# EasyEDA Pro project UHUB.eprj, board UHUB
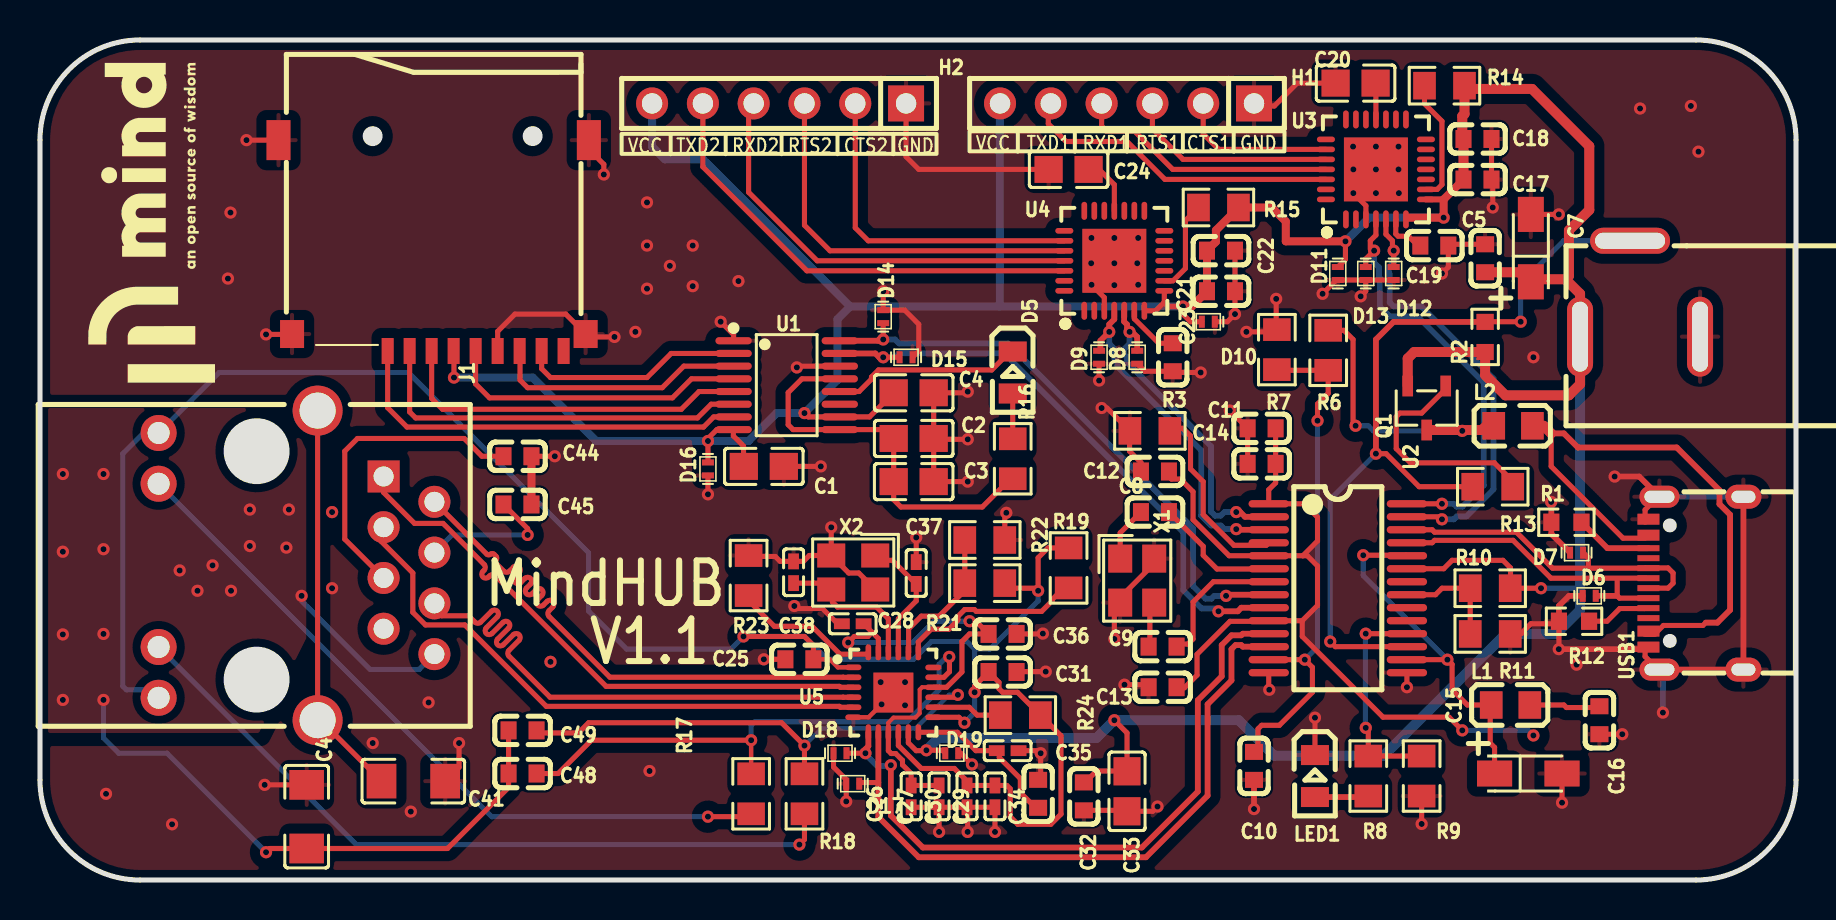
[diagram p4: board, top side]
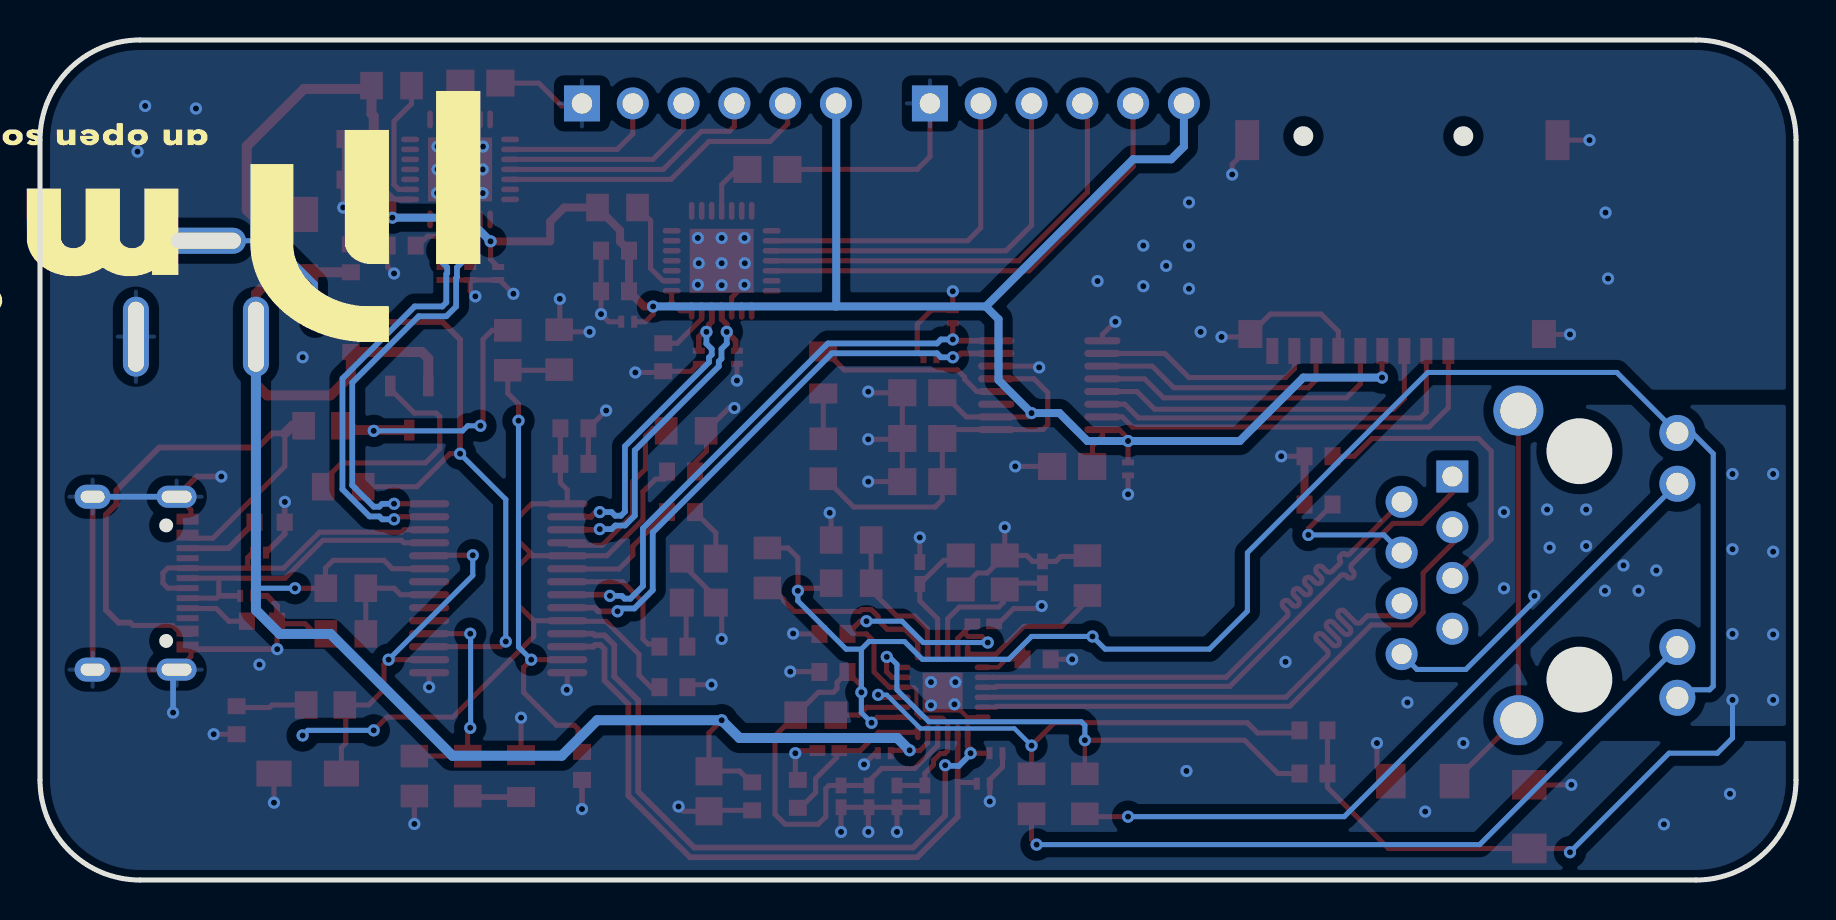
[diagram p5: board, bottom side, seen from below]

Outline 87.81 x 42.03 mm; copper layers: Top Layer, GND1, GND2, Bottom Layer. Coordinates in mm from the lower left corner of the outline.
Outline path: 0,37.03 0,5 arc(1.46,1.46) 5,0 82.81,0 arc(86.34,1.46) 87.81,5 87.81,37.03 arc(86.34,40.57) 82.81,42.03 5,42.03 arc(1.46,40.57) 0,37.03
Stack: Top Layer 0.035mm Outer layer thickness 1oz / Dielectric1 0.2104mm 7628 RC49% 8.6mil / GND1 0.0152mm Inner layer thickness / Dielectric2 1.065mm 1.1mm H/HOZ Copper / GND2 0.0152mm Inner layer thickness / Dielectric3 0.2104mm 7628 RC49% 8.6mil / Bottom Layer 0.035mm Outer layer thickness 1oz

## Design rules (mm)
net DM1: DP2
net DP1: DP2
net DM2: DP3
net DP2: DP3
net MDI0-: DP6
net MDI0+: DP6
net MDI1-: DP7
net MDI1+: DP7
net DP3: DP4
net DM3: DP4
net DM4: DP5
net DP4: DP5
net DP0+: DP1
net DM0-: DP1
template: Custom Config
spacing copperThickness1oz (default): track to track 0.102, other pairs 0.152 to 0.3
spacing copperThickness2oz: track to track 0.203, other pairs 0.152 to 0.3
spacing copperThicknessInner0.5oz: track to track 0.089, other pairs 0.152 to 0.3
track width copperThickness1oz (default): min 0.102, default 0.254, max 2.54
track width copperThickness2oz: min 0.203, default 0.254, max 2.54
track width copperThickness0.5oz: min 0.089, default 0.254, max 2.54
differential pair 100ohm (default): width min 0.127, default 0.22, max 2.54; gap min 0.203, default 0.152
differential pair 90ohm: width min 0.127, default 0.286, max 2.54; gap min 0.203, default 0.203
via viaSize (default): diameter min 0.3, default 0.61, max 10; hole min 0.2, default 0.305, max 6.3

## Placement (name value [footprint] x y rotation side)
C1  100nF  [C0805]  36.19 20.7 180 top
C2  10uF  [C0805]  43.69 22.09 180 top
C3  100nF  [C0805]  43.69 19.93 180 top
C4  10uF  [C0805]  43.69 24.38 180 top
C5  100nF  [C0603]  72.26 31.11 270 top
C7  10uF  [CAP-SMD_L3.2-W1.6-RD-C7171]  74.55 31.62 90 top
C8  20pF  [C0603]  55.75 18.41 180 top
C9  20pF  [C0603]  56.13 11.68 0 top
C10  100nF  [C0603]  60.71 5.71 90 top
C11  100nF  [C0603]  61.09 20.82 0 top
C12  100nF  [C0603]  55.75 20.44 0 top
C13  100nF  [C0603]  56.13 9.65 0 top
C14  100nF  [C0603]  61.09 22.6 0 top
C15  10uF  [CAP-SMD_L3.2-W1.6-RD-C7171]  74.42 5.33 0 top
C16  100nF  [C0603]  77.98 8 90 top
C17  100nF  [C0603]  71.88 35.05 180 top
C18  100nF  [C0603]  71.88 37.08 180 top
C19  100nF  [C0603]  69.72 31.74 0 top
C20  4.7uF  [C0805]  65.79 39.87 0 top
C21  100nF  [C0603]  59.06 29.46 180 top
C22  100nF  [C0603]  59.06 31.49 180 top
C23  100nF  [C0603]  56.64 26.16 270 top
C24  4.7uF  [C0805]  51.44 35.55 0 top
C25  100nF  [C0603]  37.97 11.04 180 top
C26  100nF  [C0402]  43.56 4.19 90 top
C27  100nF  [C0402]  44.96 4.19 90 top
C28  100nF  [C0402]  40.64 12.82 180 top
C29  100nF  [C0402]  47.75 4.19 90 top
C30  4.7nF  [C0402]  46.35 4.19 90 top
C31  100nF  [C0603]  48.13 10.41 0 top
C32  100nF  [C0603]  52.2 4.19 270 top
C33  4.7uF  [C0805]  54.36 4.44 90 top
C34  100nF  [C0603]  49.91 4.31 90 top
C35  4.7nF  [C0402]  48.39 6.47 180 top
C36  100nF  [C0603]  48.13 12.31 0 top
C37  27pF  [C0402]  43.81 15.36 270 top
C38  27pF  [C0402]  37.68 15.4 90 top
C40  1nF  [C1206]  13.33 3.17 270 top
C41  1nF  [C1206]  18.67 4.95 180 top
C44  100nF  [C0603]  23.88 21.2 0 top
C45  100nF  [C0603]  23.88 18.79 0 top
C48  100nF  [C0603]  24.13 5.33 180 top
C49  100nF  [C0603]  24.13 7.49 180 top
CARD1  TF-01A  [TF-SMD_TF-01A]  19.68 31.74 180 top
D5  KT-0805翠绿  [LED0805-R-RD]  48.64 25.39 270 top
D6  H5VL10B  [SOD-882_L1.0-W0.6-BI]  77.47 14.22 0 top
D7  H5VL10B  [SOD-882_L1.0-W0.6-BI]  76.84 16.38 0 top
D8  H5VL10B  [SOD-882_L1.0-W0.6-BI]  54.86 26.16 90 top
D9  H5VL10B  [SOD-882_L1.0-W0.6-BI]  52.96 26.16 90 top
D10  H5VL10B  [SOD-882_L1.0-W0.6-BI]  58.42 27.94 180 top
D11  H5VL10B  [SOD-882_L1.0-W0.6-BI]  64.9 30.35 90 top
D12  H5VL10B  [SOD-882_L1.0-W0.6-BI]  67.69 30.35 90 top
D13  H5VL10B  [SOD-882_L1.0-W0.6-BI]  66.29 30.35 90 top
D14  H5VL10B  [SOD-882_L1.0-W0.6-BI]  42.16 28.19 270 top
D15  H5VL10B  [SOD-882_L1.0-W0.6-BI]  43.31 26.16 180 top
D16  H5VL10B  [SOD-882_L1.0-W0.6-BI]  33.4 20.57 90 top
D17  H5VL10B  [SOD-882_L1.0-W0.6-BI]  40.64 4.82 0 top
D18  H5VL10B  [SOD-882_L1.0-W0.6-BI]  40 6.34 0 top
D19  H5VL10B  [SOD-882_L1.0-W0.6-BI]  45.59 6.34 180 top
DC1  -  [DC-IN-TH_DC-5520-1]  80.01 29.59 180 top
H1  -  [HDR-TH_6P-P2.54-V-F]  54.36 38.86 180 top
H2  -  [HDR-TH_6P-P2.54-V-F]  36.96 38.86 180 top
J1  HR911105A  [RJ45-TH_HR911105A]  12.83 15.74 270 top
L1  GZ2012D101TF  [L0805]  73.53 8.76 0 top
L2  GZ2012D101TF  [L0805]  73.66 22.73 0 top
LED1  KT-0805Y  [LED0805-R-RD]  63.75 5.2 270 top
Q1  SI2301CDS-T1-GE3  [SOT-23-3_L3.0-W1.7-P0.95-LS2.9-BR]  69.34 23.62 90 top
R1  4.7kΩ  [R0805]  72.64 19.68 180 top
R2  510kΩ  [R0603]  72.26 27.17 90 top
R3  680Ω  [R0805]  55.5 22.47 0 top
R6  10kΩ  [R0805]  64.42 26.5 90 top
R7  47kΩ  [R0805]  61.85 26.54 270 top
R8  470Ω  [R0805]  66.42 5.2 90 top
R9  150kΩ  [R0805]  69.09 5.2 90 top
R10  10kΩ  [R0805]  72.52 14.6 0 top
R11  20kΩ  [R0805]  72.52 12.31 180 top
R12  5.1kΩ  [R0603]  76.71 12.95 0 top
R13  5.1kΩ  [R0603]  76.33 17.9 0 top
R14  4.7kΩ  [R0805]  70.23 39.75 180 top
R15  4.7kΩ  [R0805]  58.93 33.65 180 top
R16  1kΩ  [R0805]  48.64 21.08 270 top
R17  680Ω  [R0805]  35.56 4.31 270 top
R18  680Ω  [R0805]  38.23 4.31 270 top
R19  10kΩ  [R0805]  51.44 15.62 90 top
R21  10kΩ  [R0805]  47.24 14.85 0 top
R22  10kΩ  [R0805]  47.24 17.01 0 top
R23  2.4kΩ  [R0805]  35.43 15.23 270 top
R24  10kΩ  [R0805]  49.02 8.25 180 top
U1  GL823K-HCY04  [SSOP-16_L4.9-W3.9-P0.64-LS6.0-BL]  37.34 24.76 270 top
U2  GL850G-HHY60  [SSOP-28_L10.2-W5.3-P0.65-LS7.8-BL]  64.9 14.6 270 top
U3  CP2102-GMR  [WQFN-28_L5.0-W5.0-P0.50-BL-EP3.2]  66.8 35.55 0 top
U4  CP2102-GMR  [WQFN-28_L5.0-W5.0-P0.50-BL-EP3.2]  53.72 30.98 0 top
U5  RTL8152B-VB-CG  [QFN-24_L4.0-W4.0-P0.50-BL-EP2.0]  42.67 9.39 270 top
USB1  TYPE-C 16PIN 2MD(073)  [USB-C-SMD_TYPE-C-6PIN-2MD-073]  82.8 14.85 90 top
X1  12MHz  [CRYSTAL-SMD_4P-L3.2-W2.5-BL]  54.86 14.98 270 top
X2  25MHz  [CRYSTAL-SMD_4P-L3.2-W2.5-BL]  40.67 15.39 180 top

## Footprints (pads in the part's own frame, mm; a bottom-side part is the same pattern mirrored in y, then rotated)
C0402
  rect 0.79x0.54 smd: 1(-0.545,0) 2(0.545,0)
C0603
  rect 0.8x0.9 smd: 1(-0.7,0) 2(0.7,0)
C0805
  rect 1.41x1.35 smd: 1(-1,0) 2(1,0)
C1206
  rect 1.485x1.728 smd: 1(-1.593,0) 2(1.593,0)
CAP-SMD_L3.2-W1.6-RD-C7171
  rect 1.758x1.296 smd: 1(-1.687,0) 2(1.687,0)
CRYSTAL-SMD_4P-L3.2-W2.5-BL
  rect 1.4x1.2 smd: 1(-1.1,-0.85) 2(1.1,-0.85) 3(1.1,0.85) 4(-1.1,0.85)
DC-IN-TH_DC-5520-1
  oval 4x1.3 hole 3.5x0.8: 2(0.5,-2.4)
  oval 1.3x4 hole 0.8x3.5: 3(-3,2.4) 4(3,2.4)
HDR-TH_6P-P2.54-V-F
  rect 1.8x1.8 hole 1.02: 1(-6.35,0)
  round 1.6 hole 1.02: 2(-3.81,0) 3(-1.27,0) 4(1.27,0) 5(3.81,0) 6(6.35,0)
L0805
  rect 1.133x1.377 smd: 1(-0.966,0) 2(0.966,0)
LED0805-R-RD
  rect 1x1.399 smd: 1(1.05,0) 2(-1.05,0)
QFN-24_L4.0-W4.0-P0.50-BL-EP2.0
  oval 0.28x0.8 smd: 1(-1.25,-2) 2(-0.75,-2) 3(-0.25,-2) 4(0.25,-2) 5(0.75,-2) 6(1.25,-2) 13(1.25,2) 14(0.75,2) 15(0.25,2) 16(-0.25,2) 17(-0.75,2) 18(-1.242,2)
  oval 0.8x0.28 smd: 7(2,-1.25) 8(2,-0.75) 9(2,-0.25) 10(2,0.25) 11(2,0.75) 12(2,1.25) 19(-2,1.25) 20(-2,0.75) 21(-2,0.25) 22(-2,-0.25) 23(-2,-0.75) 24(-2,-1.25)
  rect 2x2 smd: 25(0.013,0)
R0603
  rect 0.806x0.864 smd: 1(-0.753,0) 2(0.753,0)
R0805
  rect 1.133x1.377 smd: 1(-1,0) 2(1,0)
RJ45-TH_HR911105A
  rect 1.6x1.6 hole 1: 1(-4.45,4.355)
  round 1.6 hole 1: 2(-3.18,6.895) 3(-1.91,4.355) 4(-0.64,6.895) 5(0.63,4.355) 6(1.9,6.895) 7(3.17,4.355) 8(4.44,6.895)
  round 1.8 hole 1.1: 9(-6.625,-6.895) 10(-4.085,-6.895) 11(4.085,-6.895) 12(6.625,-6.895)
  round 2.5 hole 1.8: SH1(-7.745,1.055) SH2(7.745,1.055)
SOD-882_L1.0-W0.6-BI
  rect 0.3x0.6 smd: 1(-0.325,0) 2(0.325,0)
SOT-23-3_L3.0-W1.7-P0.95-LS2.9-BR
  rect 1.038x0.532 smd: 1(1.101,-0.95) 2(1.101,0.95) 3(-1.101,0)
SSOP-16_L4.9-W3.9-P0.64-LS6.0-BL
  oval 0.355x1.815 smd: 1(-2.223,-2.655) 2(-1.587,-2.655) 3(-0.953,-2.655) 4(-0.318,-2.655) 5(0.318,-2.655) 6(0.953,-2.655) 7(1.587,-2.655) 8(2.223,-2.655) 9(2.223,2.655) 10(1.587,2.655) 11(0.953,2.655) 12(0.318,2.655) 13(-0.318,2.655) 14(-0.953,2.655) 15(-1.587,2.655) 16(-2.223,2.655)
SSOP-28_L10.2-W5.3-P0.65-LS7.8-BL
  oval 0.364x2.015 smd: 1(-4.225,-3.455) 2(-3.575,-3.455) 3(-2.925,-3.455) 4(-2.275,-3.455) 5(-1.625,-3.455) 6(-0.975,-3.455) 7(-0.325,-3.455) 8(0.325,-3.455) 9(0.975,-3.455) 10(1.625,-3.455) 11(2.275,-3.455) 12(2.925,-3.455) 13(3.575,-3.455) 14(4.225,-3.455) 15(4.225,3.455) 16(3.575,3.455) 17(2.925,3.455) 18(2.275,3.455) 19(1.625,3.455) 20(0.975,3.455) 21(0.325,3.455) 22(-0.325,3.455) 23(-0.975,3.455) 24(-1.625,3.455) 25(-2.275,3.455) 26(-2.925,3.455) 27(-3.575,3.455) 28(-4.225,3.455)
TF-SMD_TF-01A
  rect 0.6x1.3 smd: 1(2.3,5.276) 2(1.2,5.276) 3(0.101,5.276) 4(-1,5.276) 5(-2.099,5.276) 6(-3.2,5.276) 7(-4.3,5.276) 8(-5.399,5.276) 9(-6.5,5.276)
  rect 1.2x1.4 smd: 10(-7.599,4.426) 13(7.08,4.426)
  rect 1.2x2 smd: 11(-7.76,-5.276) 12(7.76,-5.276)
USB-C-SMD_TYPE-C-6PIN-2MD-073
  rect 0.55x1.1 smd: 1(-3.2,2.375) 2(-2.4,2.375) 11(2.4,2.375) 12(3.2,2.375)
  rect 0.3x1.1 smd: 3(-1.75,2.375) 4(-1.25,2.375) 5(-0.75,2.375) 6(-0.25,2.375) 7(0.25,2.375) 8(0.75,2.375) 9(1.25,2.375) 10(1.75,2.375)
  oval 1.1x2 hole 0.6x1.5: 13(-4.325,1.825) 14(4.325,1.825)
  oval 1.2x1.8 hole 0.6x1.2: 13(-4.325,-2.375) 14(4.325,-2.375)
WQFN-28_L5.0-W5.0-P0.50-BL-EP3.2
  oval 0.28x0.9 smd: 1(-1.502,-2.5) 2(-1.001,-2.5) 3(-0.5,-2.5) 4(0,-2.5) 5(0.5,-2.5) 6(1,-2.5) 7(1.501,-2.5) 15(1.501,2.5) 16(1,2.5) 17(0.5,2.5) 18(0,2.5) 19(-0.5,2.5) 20(-1.001,2.5) 21(-1.502,2.5)
  oval 0.9x0.28 smd: 8(2.5,-1.502) 9(2.5,-1.001) 10(2.5,-0.5) 11(2.5,0) 12(2.5,0.5) 13(2.5,1) 14(2.5,1.501) 22(-2.5,1.501) 23(-2.5,1) 24(-2.5,0.5) 25(-2.5,0) 26(-2.5,-0.5) 27(-2.5,-1.001) 28(-2.5,-1.502)
  rect 3.2x3.2 smd: 29(0,0)

## Nets
As in the schematic, except:
GND: C1.1 C2.1 C3.1 C4.1 C5.1 C7.2 C10.1 C11.1 C12.1 C13.1 C14.1 C15.2 C16.1 C17.1 C18.1 C19.2 C20.1 C21.1 C22.1 C23.2 C24.1 C25.2 C26.1 C27.1 C28.2 C29.1 C30.1 C31.2 C32.2 C33.1 C34.2 C35.1 C36.2 C37.1 C38.2 C40.1 C41.1 C44.2 C45.2 CARD1.6 CARD1.10 CARD1.11 CARD1.12 CARD1.13 D6.1 D7.1 D8.1 D9.1 D10.1 D11.1 D12.1 D13.1 D14.1 D15.1 D16.1 D17.1 D18.1 D19.1 DC1.3 H1.1 H2.1 LED1.2 R3.1 R7.1 R9.1 R11.1 R12.1 R13.1 R22.2 R23.1 U1.1 U1.14 U2.14 U2.15 U3.3 U3.29 U4.3 U4.29 U5.6 U5.25 USB1.1 USB1.12 USB1.13 USB1.14 X1.2 X1.4 X2.2 X2.4
VBUS: L2.2 USB1.2 USB1.11
DM0-: D6.2 U2.25 USB1.5 USB1.7
DP0+: D7.2 U2.26 USB1.6 USB1.8
$1N13587: R12.2 USB1.4
$1N13641: R13.2 USB1.10

Pads without a net: CARD1 9; J1 7; U1 11; U2 19 20 22; U3 1 2 10 11 12 13 14 15 16 17 19 20 21 22 27 28; U4 1 2 10 11 12 13 14 15 16 17 19 20 21 22 27 28; U5 18; USB1 3 9

## Via types
v1: diameter 0.61, hole 0.305, Top Layer to Bottom Layer, 167 vias

## Routing (per net, layer and track width the routed paths; a pad name or vN(x,y) marks a point on that pad's centre or on a via; arc(x,y) is an arc through that point)
AVDD: length 3.6
  Top Layer w0.254: L1.2 76.2,8.76 76.33,8.63 77.91,8.63 C16.2
AVDD1_U: length 45
  Top Layer w0.254: 63.14,16.22 63.88,16.96 63.88,18.16 63.21,18.83 U2.1 61.44,19.53 61.79,19.87 C11.2 C14.2 ; 63.14,16.22 63.37,16.22 63.88,15.72 63.88,13.74 63.12,12.97 ; 63.14,16.22 U2.5 59.46,16.22 57.66,18.03 57.66,19.43 57.02,20.06 56.58,20.06 56.45,20.19 56.45,20.44 ; C13.2 56.86,9.62 57.22,9.62 57.86,10.25 57.86,11.3 59.51,12.94 61.41,12.94 U2.10 63.12,12.97 ; 63.12,12.97 63.12,12.19 67.16,8.15 70.46,8.15 v1(71.12,7.49)
  Bottom Layer w0.254: v1(71.12,7.49) 74.42,7.49 v1(74.68,7.23)
AVDD33: length 110.5
  Top Layer w0.221: 38.67,11.04 39.5,11.04 39.9,10.64 U5.1
  Top Layer w0.254: U5.13 45.95,8.14 v1(46.23,7.87) ; v1(35.18,12.19) 38.23,12.19 38.67,11.74 38.67,11.04 ; v1(46.74,9.39) 46.74,9.71 C31.1 47.95,9.89 47.95,9.57 48.13,9.39 48.88,9.39 R24.1 51.05,7.22 51.05,3.3 50.55,2.79 48.89,2.79 48.51,3.17 48.51,4.57 48.35,4.73 C29.2 C30.2 46.23,4.86 46.23,5.08 45.72,5.58 44.07,5.58 42.92,6.73 U5.10 ; 48.24,14.6 49.78,14.6 v1(49.91,14.47) 49.91,16.12 50.4,16.62 R19.2
  Bottom Layer w0.254: v1(46.23,7.87) 46.74,8.38 v1(46.74,9.39) 46.74,11.55 ; 46.74,11.55 47.5,11.55 49.91,13.96 v1(49.91,14.47) ; 46.74,11.55 46.35,11.93 44.58,11.93 43.69,11.04 39.37,11.04 38.23,12.19 v1(35.18,12.19) 34.54,11.55 29.34,11.55 27.43,13.46 27.43,16.38 18.41,25.39 8.96,25.39 J1.9 5.18,22.37 4.14,21.33 4.14,9.7 4.32,9.52 5.53,9.52 J1.12
DVDD: length 18.6
  Top Layer w0.254: C15.1 72.74,6.63 72.52,6.85 72.52,8.71 L1.1 71.37,8.76 70.61,9.52 70.61,10.79 v1(70.38,11.02) U2.16 ; v1(66.17,16.25) 68.33,16.25 U2.24
  Bottom Layer w0.254: v1(66.17,16.25) 66.17,15.23 v1(70.38,11.02)
DVDD10_UPS: length 7.9
  Top Layer w0.254: 49.66,3.61 49.66,3.74 49.02,4.38 49.02,5.08 47.97,6.13 47.97,6.34 C35.2 46.8,6.47 45.88,7.39 U5.12
GND: length 180.5
  Top Layer w0.221: v1(42.08,8.79) 41.44,8.14 U5.6
  Top Layer w0.25: C28.2 39.89,12.82 39.12,13.58 37.85,13.58 v1(37.72,13.71) ; C16.1 v1(79.12,7.3)
  Top Layer w0.254: v1(46.39,19.93) C3.1 C2.1 ; v1(75.95,11.55) 75.95,11.56 R12.1 75.83,12.82 74.55,12.82 74.04,12.31 R11.1 ; 43.31,38.98 43.31,36.19 43.94,35.55 C24.1 ; v1(58.04,25.39) 56.7,25.39 C23.2 55.24,25.46 D8.1 ; C2.1 44.73,22.05 v1(46.39,22.05) ; C2.1 C4.1 46.34,24.38 v1(46.39,24.44) ; 60.71,38.73 61.72,38.73 62.86,39.87 C20.1 ; v1(70.1,30.35) 70.42,30.67 C19.2 70.49,31.81 C5.1 ; C22.1 C21.1 v1(59.75,28.32) 59.37,27.94 58.87,27.94 ; 12.6,27.32 12.58,27.3 v1(11.3,27.3) ; v1(66.04,29.2) 66.29,29.46 D13.1 ; U3.3 66.3,33.74 v1(65.67,34.37) ; C35.1 49.91,6.47 v1(50.04,6.34) 50.04,5.14 49.91,5.01 ; C26.1 C27.1 ; C27.1 v1(44.96,2.41) ; C27.1 C30.1 ; 48.83,12.31 50.13,12.31 v1(50.15,12.33) ; U1.14 37.91,25.71 v1(37.85,25.65) ; 55.75,16.04 55.62,15.92 55.62,15.74 54.01,14.13 X1.2 53.72,13.59 v1(53.72,12.06) ; C1.1 38.86,20.7 ; D18.1 39.68,5.65 40.31,5.02 D17.1 v1(40.31,3.93) ; v1(48.32,18.37) 48.24,18.3 48.24,16.76 ; X2.4 40.94,15.36 40.44,15.36 X2.2 ; D19.1 46.04,6.34 v1(46.6,5.78) ; D15.1 43.94,26.47 43.94,27.81 43.24,28.51 D14.1 v1(42.16,29.46) ; C30.1 C29.1 ; C30.1 46.39,3.61 v1(46.39,2.41) ; C13.1 55.31,9.77 v1(54.23,9.77) ; U4.3 53.22,29.14 v1(52.58,29.78) ; v1(47.75,2.41) 47.75,3.64 ; v1(28.73,27.17) 27.43,27.17 26.29,28.32 23.75,28.32 22.88,27.45 CARD1.6 ; U1.1 34.68,27.29 v1(34.04,27.94) ; C25.2 v1(36.19,11.04) ; C11.1 C14.1 v1(59.5,23.49) 59.44,23.49 ; v1(10.32,37.02) 11.92,37.02 ; LED1.2 v1(63.75,8.12) ; v1(50.29,10.43) 48.85,10.43 48.83,10.41 ; v1(53.09,23.62) 53.36,23.62 R3.1 54.48,22.46 54.48,21.46 55.05,20.89 C12.1 ; v1(52.96,24.99) D9.1 ; C37.1 v1(43.81,17.14) ; 27.94,36.06 28.19,35.81 v1(28.19,35.3) ; C15.2 v1(76.11,3.87) ; 80.26,11.5 80.26,11.18 80.91,10.53 ; v1(20.95,6.85) 20.95,5.64 C41.1 ; 80.26,17.9 80.26,18.52 80.91,19.17 ; U2.15 v1(68.35,9.65) ; v1(60.32,27.43) 61.73,27.43 61.81,27.51 v1(61.81,29.08) ; 11.18,4.82 v1(11.23,4.76) C40.1 ; D13.1 D11.1 64.83,30.02 v1(64.13,29.33) ; D13.1 D12.1 ; D16.1 v1(33.4,19.3) ; v1(72.64,33.65) 72.64,34.98 C17.1 C18.1 ; C32.2 54.31,3.49 C33.1 55.64,3.44 v1(55.88,3.68) ; X2.2 v1(39.57,17.65) ; X2.2 38.47,16.24 38.17,15.94 C38.2 37.01,15.94 36.76,16.19 35.94,16.19 35.64,16.49 ; R9.1 v1(69.09,2.8) ; v1(61.47,9.52) 61.44,9.55 U2.14 ; C44.2 25.78,21.2 ; C7.2 v1(75.95,33.3)
  Top Layer w0.286: R12.1 75.95,13.72 76.45,14.22 D6.1 ; 80.98,19.18 79.97,20.19 v1(78.74,20.19) ; USB1.14 USB1.13 80.98,10.53 ; v1(75.95,11.55) 80.33,11.55 USB1.1 ; v1(75.56,18.92) 75.57,18.91 R13.1 75.57,17.31 D7.1 ; C10.1 v1(60.71,3.55)
  Top Layer w0.4: C45.2 C44.2
  Bottom Layer w0.286: 80.98,10.53 81.15,10.35 v1(81.15,8.38) ; 80.98,19.18 USB1.14
  vias: v1(3.3,4.31) v1(6.6,2.79) v1(9.4,30.09) v1(9.52,33.4) v1(14.6,18.41) v1(14.6,14.6) v1(16.64,6.85) v1(18.54,3.42) v1(19.43,8.88) v1(25.53,10.92) v1(25.74,21.2) v1(29.77,27.43) v1(30.35,33.9) v1(30.35,31.74) v1(30.35,29.59) v1(30.48,5.46) v1(31.5,30.73) v1(32.64,31.74) v1(32.64,29.71) v1(34.92,29.97) v1(39.04,20.7) v1(42.04,9.9) v1(43.26,9.9) v1(43.26,8.74) v1(52.58,32.13) v1(52.56,30.86) v1(53.72,32.13) v1(53.72,30.86) v1(53.72,29.76) v1(54.87,30.86) v1(54.91,32.13) v1(54.91,29.78) v1(65.66,36.7) v1(65.67,35.55) v1(66.8,36.7) v1(66.8,35.55) v1(66.8,34.37) v1(67.93,36.7) v1(67.93,35.55) v1(67.95,34.37) v1(74.68,26.16) v1(76.84,10.78) v1(80.01,38.6) v1(82.55,38.73) v1(82.93,36.44)
PGND: length 37.4
  Top Layer w0.254: v1(11.3,1.39) 11.49,1.58 C40.2 20.38,1.58 23.43,4.63 C48.2 C49.2
  Bottom Layer w0.254: J1.8 18.95,10.54 16.51,10.54 13.08,13.96 v1(13.08,14.22) ; v1(3.17,9.01) 3.17,7.11 3.94,6.34 6.35,6.34 v1(11.3,1.39)
  vias: v1(1.14,20.31) v1(1.14,16.43) v1(1.14,12.29) v1(1.14,9.01) v1(3.17,20.31) v1(3.17,16.55) v1(3.17,12.31) v1(6.98,15.49) v1(7.87,14.47) v1(8.63,15.74) v1(9.55,14.47) v1(10.49,18.54) v1(10.49,16.71) v1(12.32,16.63) v1(12.45,18.54)
VBUS: length 29.5
  Top Layer w0.25: 80.74,12.3 81.18,12.74 83.15,12.74 83.29,12.88
  Top Layer w0.254: 75.56,22.35 75.56,20.7 79.16,17.1 80.26,17.1
  Top Layer w0.29: 75.56,22.35 76.2,22.35 76.91,21.64 81.84,21.64 83.98,19.5 83.98,18.81 84.51,18.28 84.51,13.51 83.88,12.88 83.29,12.88 ; 80.74,12.3 80.26,12.3
  Top Layer w0.5: L2.2 75.18,22.73 75.56,22.35
VCC: length 217.9
  Top Layer w0.254: 34.67,22.53 33.83,22.53 33.4,22.09 v1(33.4,21.97) D16.2 ; 34.67,22.53 34.67,22.22 35.18,21.71 35.18,21.33 35.19,21.31 C1.2 ; 34.67,22.53 U1.8 ; C4.2 41.48,23.17 U1.10 38.42,23.17 v1(38.23,23.36) ; U5.11 43.42,6.86 43.81,6.47 44.3,6.47 v1(44.32,6.49) 45.12,6.49 D19.2 ; D10.2 57.53,27.94 57.15,28.32 v1(57.15,28.7) ; U2.23 70.19,15.58 70.61,16 73.15,16 73.53,15.62 73.53,14.62 R10.2 v1(75.06,14.6) ; v1(20.7,25.14) 20.7,26.45 CARD1.4 ; C32.1 52.26,4.89 52.83,5.46 54.34,5.46 C33.2 54.36,7.36 v1(53.72,8) ; U4.7 55.79,28.48 56.22,28.91 U4.8 56.37,29.48 ; D11.2 65.28,31.05 v1(65.28,31.96)
  Top Layer w0.286: 56.22,28.91 56.44,28.7 v1(57.15,28.7)
  Top Layer w0.3: U3.8 70.19,34.05
  Top Layer w0.4: v1(65.28,31.96) 62.3,31.96 62.3,32.95 61.59,33.65 R15.1 59.93,33.63 58.8,32.51 58.8,31.94 58.35,31.49 58.35,29.46 57.59,28.7 v1(57.15,28.7) ; C17.2 70.19,34.05 v1(70.19,33.14) 68.39,33.14
  Top Layer w0.5: Q1.2 68.39,26.1 68.71,26.42 R2.1 72.26,25.27 73.28,24.25 76.45,24.25 77.01,24.81 DC1.4 77.01,29.33 76.28,30.06 ; 76.28,30.06 76.45,30.23 76.45,32.51 77.47,33.52 77.47,36.72 74.61,39.58 71.4,39.58 R14.1 71.23,38.33 71.12,38.22 71.12,37.14 C18.2 C17.2 ; 76.28,30.06 74.33,30.06 73.98,30.41 C5.2
  Bottom Layer w0.254: 77.01,14.66 76.95,14.6 v1(75.06,14.6)
  Bottom Layer w0.4: 47.99,28.7 v1(57.15,28.7) ; 47.99,28.7 40.51,28.7 ; 47.99,28.7 47.99,38.85 H1.6 ; 40.51,28.7 33.15,36.06 31.24,36.06 30.61,36.7 H2.6 ; 40.51,28.7 39.88,28.06 39.88,25.01 v1(38.23,23.36) 36.83,23.36 35.43,21.97 v1(33.4,21.97) 27.81,21.97 24.64,25.14 v1(20.7,25.14) ; v1(70.19,33.14) 66.46,33.14 v1(65.28,31.96)
  Bottom Layer w0.5: v1(44.32,6.49) 44.94,7.11 52.83,7.11 v1(53.72,8) 59.94,8 61.72,6.22 67.18,6.22 73.28,12.31 75.82,12.31 77.01,13.5 DC1.4
VDD: length 18.9
  Top Layer w0.254: U1.13 38.1,25.08 37.41,24.39 37.41,22.78 37.66,22.54 U1.9 42.24,22.54 C2.2 C3.2 42.69,19.03 43.05,18.66 47.12,18.66 48.01,19.55
VDD10: length 24.3
  Top Layer w0.2: U5.9 42.42,7.4 42.42,7.87 42.68,8.13 43.78,8.13 43.99,8.34 43.99,9.53 44.11,9.65 44.67,9.65 U5.16
  Top Layer w0.25: U5.23 41.92,12.08 41.19,12.82
  Top Layer w0.254: U5.16 45.34,9.64 46.1,10.41 46.1,11.93 46.48,12.31 C36.1 46.8,12.95 v1(46.48,12.95) ; 41.53,12.31 41.4,12.19 40.72,12.19 v1(40.41,11.88) ; C27.2 C26.2 43.56,5.33 43.13,5.77 43.13,5.99 42.79,6.33 42.56,6.33 42.42,6.47 U5.9
  Bottom Layer w0.254: v1(46.48,12.95) 44.7,12.95 43.64,11.88 v1(40.41,11.88)
B_VCC: length 14.3
  Top Layer w0.254: R6.2 65.2,27.5 65.66,27.05 65.66,22.85 v1(65.79,22.73)
  Top Layer w0.5: Q1.3 72.1,22.52 72.31,22.73
  Bottom Layer w0.254: v1(71.12,22.47) 66.67,22.47 66.42,22.73 v1(65.79,22.73)
CLK: length 15.2
  Top Layer w0.254: U1.4 32.58,25.08 31.62,24.12 22.48,24.12 21.78,24.82 21.78,26.46 CARD1.5
CMD: length 18.1
  Top Layer w0.254: U1.5 32.96,24.44 32.07,23.55 20.13,23.55 19.58,24.1 CARD1.3
CTS1: length 7.9
  Top Layer w0.254: 58.17,38.73 58.17,37.33 58.94,36.56 U3.23
CTS2: length 17.1
  Top Layer w0.254: U4.23 41.42,31.98 40.77,32.63 40.77,38.98
D0: length 12.7
  Top Layer w0.254: CARD1.7 24,26.45 24,25.01 24.38,24.63 31.11,24.63 32.19,25.71 U1.3
D1: length 11.2
  Top Layer w0.254: U1.2 31.56,26.35 30.35,25.14 25.53,25.14 25.08,25.58 CARD1.8
D2: length 20.7
  Top Layer w0.254: CARD1.1 17.38,23.63 18.35,22.66 33.18,22.66 33.69,23.17 U1.7
D3: length 19.7
  Top Layer w0.254: CARD1.2 18.48,23.42 18.78,23.12 32.88,23.12 33.56,23.81 U1.6
DM0-: length 16.1
  Top Layer w0.254: 80.26,15.1 77.96,15.1 77.95,15.1 75.55,15.1 ; 75.55,15.11 73.66,17 69.74,17 69.61,16.88 U2.25 ; 80.26,14.1 78.98,14.1 78.87,14.22 78.87,15.01
  Top Layer w0.286: D6.2 78.87,14.22
DM1: length 22.5
  Top Layer w0.254: v1(70.1,18.05) 69.98,18.17 U2.27 ; 67.69,30.73 v1(67.69,31.49) 67.63,31.55 67.63,31.99 67.3,32.31 U3.5
  Bottom Layer w0.286: v1(70.1,18.05) 70.69,18.05 70.84,18.19 71.33,18.19 72.68,19.55 72.68,25.09 69.07,28.7 67.69,28.7 67.49,28.9 67.49,30.33 67.45,30.37 67.45,30.66 67.69,30.9 v1(67.69,31.49)
DM2: length 16.4
  Top Layer w0.286: D8.2 54.86,27.17 54.61,27.43 v1(54.48,27.43) 54.36,27.55 54.36,27.8 54.21,27.94 54.21,28.47 U4.5 ; U2.2 60.25,18.17 60.02,18.41 v1(59.82,18.41)
  Bottom Layer w0.286: v1(54.48,27.43) 54.48,26.84 54.22,26.57 54.22,26.29 54.36,26.15 54.36,25.9 58.56,21.7 58.56,18.43 58.76,18.23 59.04,18.23 59.23,18.41 v1(59.82,18.41)
DM3: length 29.4
  Top Layer w0.254: v1(42.16,27.05) D14.2
  Top Layer w0.286: U1.16 41.9,26.98 41.96,27.05 v1(42.16,27.05) ; v1(59.31,14.22) 59.36,14.27 U2.8
  Bottom Layer w0.286: v1(42.16,27.05) 42.75,27.05 42.96,26.85 48.41,26.85 57.66,17.6 57.66,14.71 58.29,14.08 58.58,14.08 58.72,14.22 v1(59.31,14.22)
DM4: length 33.7
  Top Layer w0.254: D18.2 v1(41.28,6.34)
  Top Layer w0.286: v1(41.28,6.34) 41.28,6.55 41.42,6.69 U5.7 ; v1(42.54,5.75) 42.54,3.23 44.14,1.63 55.1,1.63 57.9,4.42 57.9,9 59.09,10.19 59.09,11.76 59.58,12.24 60.07,12.24 60.15,12.33 U2.11
  Bottom Layer w0.286: v1(42.54,5.75) 42.51,5.71 41.86,5.71 41.28,6.3 v1(41.28,6.34)
DP0+: length 17.1
  Top Layer w0.254: 77.42,15.61 77.42,16.13 77.17,16.38 ; 80.26,14.6 81.41,14.6 81.66,14.85 81.66,15.36 81.41,15.62 80.27,15.62 80.26,15.6 75.63,15.6 73.83,17.4 69.74,17.4 69.61,17.52 U2.26
DP1: length 21.8
  Top Layer w0.254: 66.52,31.55 66.52,31.99 66.8,32.27 U3.4 ; v1(66.71,31.49) 66.29,31.07 D13.2 ; U2.28 v1(70.1,18.83)
  Bottom Layer w0.286: v1(70.1,18.83) 70.69,18.83 70.84,18.68 71.12,18.68 72.19,19.75 72.19,24.89 68.87,28.21 67.49,28.21 67,28.7 67,30.12 66.96,30.17 66.96,30.66 66.71,30.9 v1(66.71,31.49)
DP2: length 17.1
  Top Layer w0.286: U2.3 59.85,17.52 v1(59.82,17.56) ; D9.2 53.03,26.55 53.03,26.98 v1(53.47,27.43) 53.47,27.8 53.72,28.06 U4.4
  Bottom Layer w0.286: v1(53.47,27.43) 53.47,26.84 53.73,26.57 53.73,26.08 53.87,25.95 53.87,25.7 58.07,21.5 58.07,18.23 58.56,17.74 59.04,17.74 59.23,17.56 v1(59.82,17.56)
DP3: length 29.7
  Top Layer w0.254: v1(42.16,26.16) 42.98,26.16
  Top Layer w0.286: U1.15 41.77,26.35 41.96,26.16 v1(42.16,26.16) ; U2.9 60.07,13.62 59.89,13.45 v1(58.93,13.45)
  Bottom Layer w0.286: v1(42.16,26.16) 42.75,26.16 42.96,26.36 48.21,26.36 57.17,17.39 57.17,14.51 58.09,13.59 58.96,13.59 58.93,13.56 v1(58.93,13.45)
DP4: length 33.6
  Top Layer w0.254: 40.97,4.82 41.02,4.88 41.92,4.88
  Top Layer w0.286: U5.8 41.92,3.16 43.94,1.14 55.3,1.14 58.38,4.22 58.38,8.79 59.58,9.99 59.58,11.55 59.78,11.76 60.07,11.76 60.15,11.67 U2.12
ELDG: length 27.6
  Top Layer w0.221: R17.1 v1(35.56,7)
  Top Layer w0.254: v1(35.56,7) 27.58,7 25.91,5.33 C48.1 ; v1(45.47,11.16) 45.48,11.15 45.48,10.42 45.2,10.14 U5.17
  Bottom Layer w0.254: v1(35.56,7) 35.56,7.74 35.74,7.92 43.36,7.92 44.96,9.52 44.96,10.79 45.33,11.16 v1(45.47,11.16)
ELDY: length 25.5
  Top Layer w0.254: v1(45.9,9.27) 45.78,9.14 U5.15 ; R18.1 v1(38.23,6.73) 37.08,7.87 27.43,7.87 26.92,7.36 24.96,7.36 C49.1
  Bottom Layer w0.221: v1(45.9,9.27) 45.47,9.27 43.78,7.58 39.08,7.58 v1(38.23,6.73)
EX1: length 6.4
  Top Layer w0.254: U5.21 42.92,13.07 43.81,13.96 C37.2 43.69,14.94 43.67,14.94 42.62,16 42.26,16 42.02,16.24 X2.1
EX2: length 7.5
  Top Layer w0.254: U5.22 42.42,13.07 41.84,13.66 39.88,13.66 39.62,13.91 39.62,14.48 X2.3 39.25,14.85 C38.1
LED: length 9.5
  Top Layer w0.254: D5.2 48.51,26.45 47.59,25.52 41.93,25.52 41.58,25.17 41.58,25.06 40.96,24.44 U1.12
MDI0+: length 29
  Top Layer w0.254: J1.2 22.34,16.3 arc(22.43,16.26) 22.52,16.3 arc(22.61,16.34) 22.7,16.3 22.81,16.2 arc(22.84,16.11) 22.81,16.02 arc(22.77,15.93) 22.81,15.84 23.19,15.45 arc(23.33,15.39) 23.47,15.45 23.68,15.66 arc(23.96,15.66) 23.96,15.37 23.76,15.17 arc(23.76,14.89) 24.04,14.89 24.24,15.09 arc(24.53,15.09) 24.53,14.81 24.32,14.6 arc(24.32,14.32) 24.61,14.32 24.81,14.53 arc(25.09,14.53) 25.09,14.24 24.89,14.04 arc(24.89,13.76) 25.17,13.76 25.36,13.94 arc(25.64,13.94) 25.64,13.66 25.45,13.47 arc(25.4,13.33) 25.45,13.19 28.5,10.15 40.16,10.15 40.16,10.14 U5.2
MDI0-: length 29
  Top Layer w0.254: J1.1 17.18,19.39 18.73,17.84 20.15,17.84 22.21,15.79 arc(22.27,15.65) 22.21,15.51 22.15,15.45 arc(22.15,15.16) 22.43,15.16 22.49,15.22 arc(22.63,15.28) 22.78,15.22 28.31,9.69 39.97,9.69 40.02,9.64 U5.3
MDI1+: length 29
  Top Layer w0.254: U5.4 40.16,9.14 40.16,9.15 25.51,9.15 23.45,11.21 arc(23.39,11.35) 23.45,11.49 23.96,12 arc(23.96,12.28) 23.67,12.28 23.16,11.77 arc(22.88,11.77) 22.88,12.05 23.43,12.6 arc(23.43,12.89) 23.15,12.89 22.6,12.34 arc(22.32,12.34) 22.32,12.62 22.87,13.17 arc(22.87,13.45) 22.58,13.45 22.03,12.9 arc(21.89,12.84) 21.75,12.9 21.43,13.22 20.09,13.22 19.72,13.59 J1.6
MDI1-: length 29
  Top Layer w0.254: J1.3 17.06,17.53 17.06,16.94 18.64,15.36 18.64,13.4 19.27,12.76 21.24,12.76 25.32,8.69 39.97,8.69 40.02,8.64 U5.5
OVCUR1#: length 5.6
  Top Layer w0.254: R11.2 R10.1 70.1,14.6 69.78,14.27 U2.21
PGANG: length 11
  Top Layer w0.254: v1(66.29,7.61) 66.42,7.49 R8.2 R9.2 ; U2.18 v1(66.29,12.33)
  Bottom Layer w0.254: 66.28,12.44 66.28,7.63 v1(66.29,7.61)
PSELF: length 41.8
  Top Layer w0.254: v1(74.04,27.94) 72.27,27.94 72.26,27.92 ; v1(64.52,11.93) 64.77,11.67 U2.17 ; v1(66.8,21.33) 67.31,21.33 68.96,19.68 72.03,19.68
  Top Layer w0.286: v1(66.8,21.33) 66.8,27.05 67.68,27.92 72.26,27.92
  Bottom Layer w0.254: v1(66.8,21.33) 64.52,19.05 v1(64.52,11.93) ; DC1.2 76.19,31.99 74.04,29.84 v1(74.04,27.94)
RESET: length 25.9
  Top Layer w0.254: 61.82,25.5 R6.1 64.42,24.35 63.88,23.82 v1(63.88,22.98) ; C10.2 60.91,6.61 60.91,7.56 61.09,7.74 61.98,7.74 63.63,9.39 63.63,10.64 v1(63.25,11.02) U2.13 61.42,11.04
  Bottom Layer w0.254: v1(63.88,22.98) 63.88,11.66 v1(63.25,11.02)
RREF: length 9.4
  Top Layer w0.254: U2.4 61.31,16.75 59.7,16.75 58.17,18.28 58.17,19.93 57.53,20.57 57.53,22.22 57.15,22.6 56.63,22.6 56.5,22.73
RTS1: length 10.5
  Top Layer w0.254: 55.63,38.73 55.63,37.59 57.16,36.06 U3.24
RTS2: length 19.7
  Top Layer w0.254: 38.23,38.98 38.23,32.76 39.5,31.48 U4.24
RXD1: length 13.1
  Top Layer w0.254: 53.09,38.73 53.09,37.71 53.34,37.46 54.74,37.46 56.64,35.55 U3.25
RXD2: length 22
  Top Layer w0.254: U4.25 38.86,30.98 35.43,34.41 35.43,38.86 35.56,38.98 35.69,38.98
TXD1: length 16
  Top Layer w0.254: U3.26 56.25,35.05 54.36,36.95 51.31,36.95 50.42,37.84 50.42,38.6 50.55,38.73
TXD2: length 23.5
  Top Layer w0.254: U4.26 38.35,30.48 33.15,35.68 33.15,38.98
X1: length 6.4
  Top Layer w0.254: 56.45,18.41 58.17,16.7 58.17,16.25 58.85,15.56 61.43,15.56 ; 61.44,15.56 61.43,15.56 ; 61.43,15.56 U2.6
X2: length 7
  Top Layer w0.254: C9.2 56.96,11.81 57.4,11.81 57.66,12.06 57.66,13.91 58.67,14.92 U2.7
$1N1679: length 2.8
  Top Layer w0.254: C8.2 54.01,17.37 X1.1
$1N1684: length 2.5
  Top Layer w0.254: C9.1 55.5,11.74 55.5,13.33 56.05,13.88
$1N2871: length 2.7
  Top Layer w0.286: R8.1 66.37,4.15 LED1.1
$1N4675: length 11.8
  Top Layer w0.254: 74.03,19.68 73.91,19.68 72.72,20.87 68.53,20.87 67.82,21.58 67.82,23.18 68,23.36 69.09,23.36 70.29,24.57 Q1.1
$1N13587: length 3.1
  Top Layer w0.254: 80.26,13.6 80.24,13.58 78.99,13.58 78.36,12.95 R12.2
$1N13641: length 3.9
  Top Layer w0.286: USB1.10 78.38,16.6 R13.2
$2N485: length 2.2
  Top Layer w0.254: C19.1 68.9,31.74 68.43,32.21 67.91,32.21 67.79,32.33 67.79,33.05 U3.6
$2N582: length 1.8
  Top Layer w0.254: C20.2 66.8,39.86 U3.18
$2N648: length 6.2
  Top Layer w0.254: U3.9 69.86,34.55 70.1,34.79 70.1,37.97 69.23,38.84 R14.2
$2N1526: length 4.6
  Top Layer w0.254: U4.9 56.66,29.98 57.28,30.6 57.28,33 R15.2
$2N1544: length 2.8
  Top Layer w0.254: U4.6 54.72,28.08 55.95,26.86 C23.1
$2N1563: length 2.9
  Top Layer w0.254: U4.18 53.72,34.79 52.96,35.55 C24.2
$3N719: length 2.3
  Top Layer w0.254: R16.1 D5.1
$4N1390: length 36.6
  Top Layer w0.254: v1(33.4,3.17) 35.42,3.17 R17.2
  Bottom Layer w0.254: J1.10 22.59,3.17 v1(33.4,3.17)
$4N1394: length 37.8
  Top Layer w0.254: R18.2 38.23,2.03 v1(37.97,1.77)
  Bottom Layer w0.254: v1(37.97,1.77) 15.82,1.77 J1.11
$4N2084: length 7.1
  Top Layer w0.254: 46.24,16.76 46.24,14.49 44.96,13.2 44.07,13.2 43.43,12.57 43.43,11.41 U5.20
$4N2129: length 9.4
  Top Layer w0.254: U5.19 43.92,11.91 44.56,12.55 45.45,12.55 45.9,13 45.9,13.19 46.24,13.53 46.72,13.53 46.82,13.44 50.09,13.44 50.62,13.98 50.62,14.04 51.18,14.6 51.42,14.6 R19.1
$4N2509: length 7.4
  Top Layer w0.254: U5.24 41.33,11.3 40,11.3 38.61,12.69 36.72,12.69 35.43,13.98 R23.2
$4N5193: length 19.9
  Top Layer w0.254: J1.SH1 J1.SH2 14.03,8 C41.2
$4N5478: length 15.7
  Top Layer w0.254: J1.5 15.24,17.05 15.24,21.46 15.88,22.09 21.21,22.09 22.1,21.2 C44.1
$4N5537: length 7.1
  Top Layer w0.254: C45.1 24.38,17.58 v1(24.38,17.27)
  Bottom Layer w0.254: J1.4 20.61,17.27 v1(24.38,17.27)
$4N7995: length 3.5
  Top Layer w0.254: U5.14 46.47,8.64 46.86,8.25 R24.2

## Copper pours and planes (outline as drawn; the poured copper is in the pictures)
AVDD1_U on Top Layer: 63.25,17.11 64.01,17.11 64.01,15.59 63.25,15.59
AVDD1_U on Top Layer: 63.12,13.86 64.01,13.86 64.01,11.42 63.12,11.42
GND on Top Layer: -0.25,42.03 88.01,42.03 88.01,-0.51 -0.25,-0.51
GND on Bottom Layer: 0.25,42.92 88.01,42.92 88.01,-0.39 0.25,-0.39
GND on Bottom Layer: -0.25,41.91 88.14,41.91 88.14,-0.39 -0.25,-0.39
GND on GND1: -0.51,5.96 18.41,5.96 18.41,-0.26 -0.51,-0.26
GND on GND1: -0.64,42.16 88.26,42.16 88.26,-0.01 -0.64,-0.01
GND on GND2: -1.02,42.16 88.26,42.16 88.26,-0.39 -1.02,-0.39
PGND on Top Layer: -0.72,23.77 12.43,23.77 13.46,21.55 13.46,12.06 11.04,7.21 -0.72,7.21
PGND on Bottom Layer: -0.66,24.02 12.5,24.02 13.52,21.81 13.52,11.17 12.38,8.88 12.38,7.46 -0.66,7.46
PGND on GND1: -0.64,25.45 14.93,25.45 15.62,24.76 15.62,22.35 13.97,20.7 13.97,10.92 15.75,9.14 15.75,6.6 15.24,6.09 0.51,6.09 -0.64,7.23
PGND on GND2: -0.85,24.02 12.31,24.02 13.33,21.81 13.33,11.17 12.19,8.88 12.19,7.46 -0.85,7.46

Small or netless copper shapes (teardrops, artwork), in the pictures only: 1 on Top Layer

## Text on the board
Top Silkscreen Layer: VCC | TXD2 | RXD2 | RTS2 | CTS2 | GND | TXD1 | RXD1 | RTS1 | CTS1 | MindHUB | V1.1
